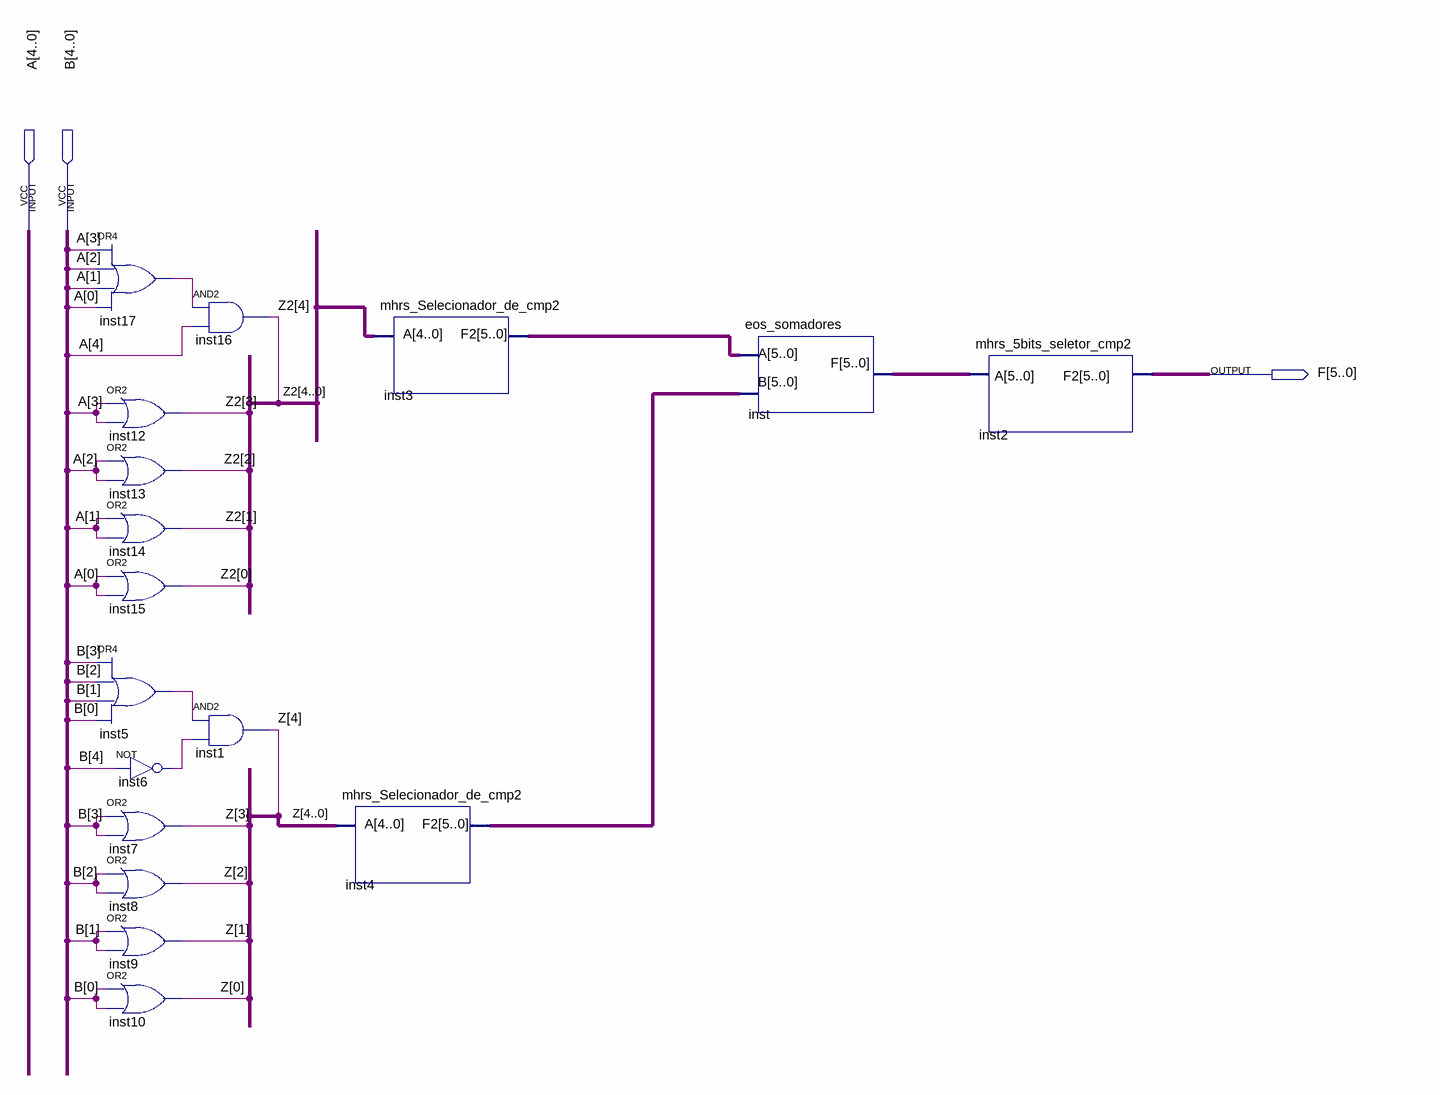
[diagram p0: schematic sheet]
// Quartus schematic mhrs_A_menos_B.bdf as structural Verilog: 17 symbols, 3 pins
module mhrs_A_menos_B (
  input  [4:0] A,
  input  [4:0] B,
  output [5:0] F
);

  wire inst5_out, inst6_out, inst17_out;
  wire [4:0] Z, Z2;
  wire [5:0] inst3_f2, inst4_f2, inst_f;

  or inst17 (inst17_out, A[3], A[2], A[1], A[0]);
  or inst12 (Z2[3], A[3], A[3]);
  or inst13 (Z2[2], A[2], A[2]);
  or inst14 (Z2[1], A[1], A[1]);
  or inst15 (Z2[0], A[0], A[0]);
  or inst5 (inst5_out, B[3], B[2], B[1], B[0]);
  not inst6 (inst6_out, B[4]);
  or inst7 (Z[3], B[3], B[3]);
  or inst8 (Z[2], B[2], B[2]);
  or inst9 (Z[1], B[1], B[1]);
  or inst10 (Z[0], B[0], B[0]);
  and inst16 (Z2[4], inst17_out, A[4]);
  and inst1 (Z[4], inst5_out, inst6_out);
  mhrs_Selecionador_de_cmp2 inst3 (.A(Z2), .F2(inst3_f2));
  mhrs_Selecionador_de_cmp2 inst4 (.A(Z), .F2(inst4_f2));
  eos_somadores inst (.A(inst3_f2), .B(inst4_f2), .F(inst_f));
  mhrs_5bits_seletor_cmp2 inst2 (.A(inst_f), .F2(F));
endmodule
